# EAGLE schematic Galaksija keyboard cover for rev3 (EAGLE 9.6.2)
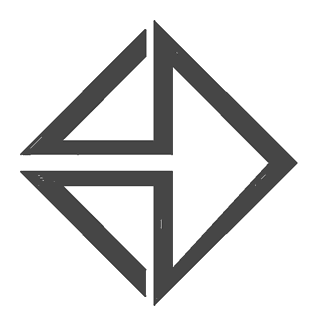
[diagram p0: schematic, sheet 1]

## Parts
U$1  LOGO-GAL  [GALAKSIJA-LOGO]

## Library data of the parts
U$1 = logo-galaksija:LOGO-GAL